# Altium schematic sheet Power.SchDoc: 电源电路
size A4
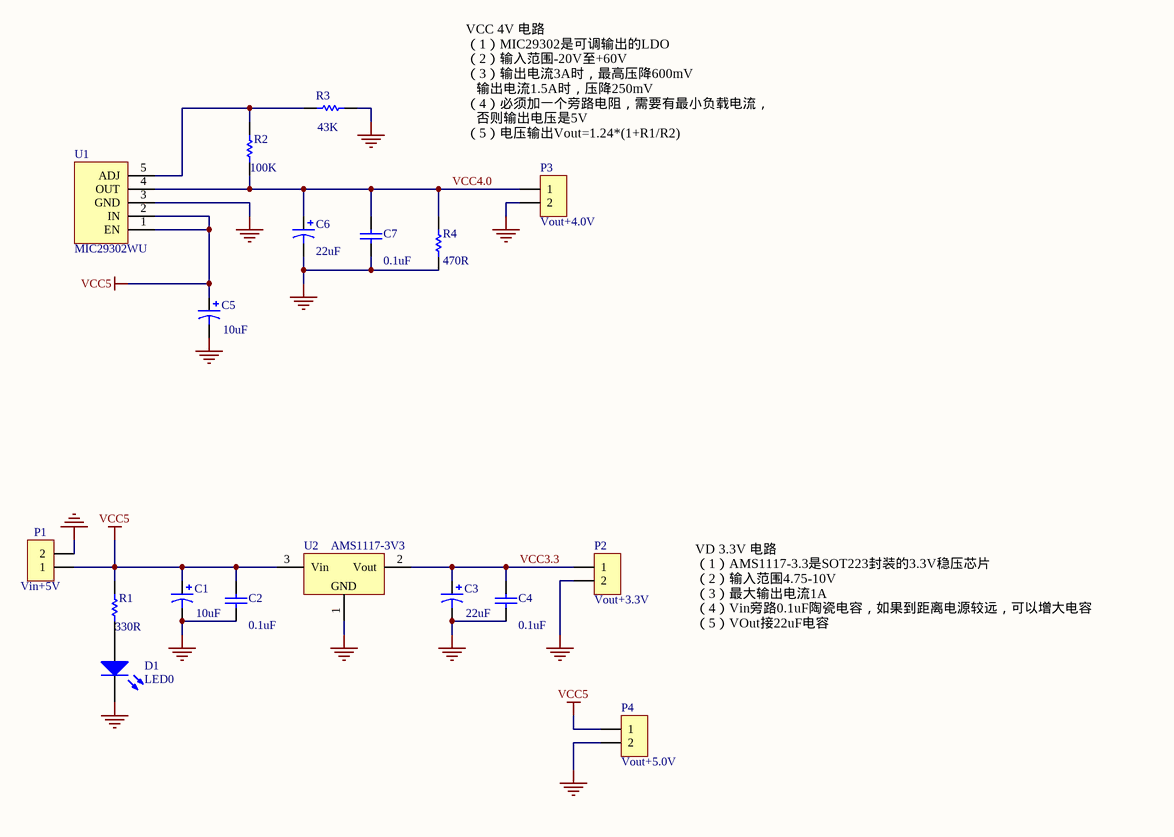
[diagram p0: Power.SchDoc]

## Parts
C1  value 10uF  [CAP 2.0*5*11 - BK]  (hidden comment: Cap Pol1)
C2  value 0.1uF  [CC 2.2*5]  (hidden comment: Cap)
C3  value 22uF  [CAP 2.0*5*11 - BK]  (hidden comment: Cap Pol1)
C4  value 0.1uF  [CC 2.2*5]  (hidden comment: Cap)
C5  value 10uF  [CAP 2.0*5*11 - BK]  (hidden comment: Cap Pol1)
C6  value 22uF  [CAP 2.0*5*11 - BK]  (hidden comment: Cap Pol1)
C7  value 0.1uF  [CC 2.2*5]  (hidden comment: Cap)
D1  LED0  [LED 3MM-R]
P1  Vin+5V  [XH2.54-2P]
P2  Vout+3.3V  [XH2.54-2P]
P3  Vout+4.0V  [XH2.54-2P]
P4  Vout+5.0V  [XH2.54-2P]
R1  value 330R  [RS 1/4W]  (hidden comment: Res1)
R2  value 100K  [RS 1/4W]  (hidden comment: Res1)
R3  value 43K  [RS 1/4W]  (hidden comment: Res1)
R4  value 470R  [RS 1/4W]  (hidden comment: Res1)
U1  MIC29302WU  [TO263-5]
U2  AMS1117-3V3  [SOT223_M]

## Nets
GND: C1.2 C2.1 C3.2 C4.1 C5.2 C6.2 C7.1 D1.2(K) P1.2 P2.2 P3.2 P4.2 R3.1 R4.1 U1.3(GND) U2.1(GND)
VCC5: C1.1 C2.2 C5.1 P1.1 P4.1 R1.2 U1.1(EN) U1.2(IN) U2.3(Vin)
VCC3.3: C3.1 C4.2 P2.1 U2.2(Vout)
VCC4.0: C6.1 C7.2 P3.1 R2.1 R4.2 U1.4(OUT)
NetD1_1: D1.1(A) R1.1
NetR2_2: R2.2 R3.2 U1.5(ADJ)

## Notes on the sheet
- (near P3) VCC 4V 电路
  （1）MIC29302是可调输出的LDO
  （2）输入范围-20V至+60V
  （3）输出电流3A时，最高压降600mV
  输出电流1.5A时，压降250mV
  （4）必须加一个旁路电阻，需要有最小负载电流，
  否则输出电压是5V
  （5）电压输出Vout=1.24*(1+R1/R2)
- VD 3.3V 电路
  （1）AMS1117-3.3是SOT223封装的3.3V稳压芯片
  （2）输入范围4.75-10V
  （3）最大输出电流1A
  （4）Vin旁路0.1uF陶瓷电容，如果到距离电源较远，可以增大电容
  （5）VOut接22uF电容

## Library data of the parts
C1 C3 C5 C6 = Cap Pol1: Polarized Capacitor (Radial); Published: 8-Jun-2000; LatestRevisionDate: 17-Jul-2002; LatestRevisionNote: Re-released for DXP Platform.; PackageReference: RB7.6-15; Publisher: Altium Limited; PackageDescription: Polarized Capacitor (Radial); 2 Leads
C2 C4 C7 = Cap: Capacitor; Published: 8-Jun-2000; LatestRevisionDate: 17-Jul-2002; LatestRevisionNote: Re-released for DXP Platform.; PackageReference: RAD-0.3; Publisher: Altium Limited; PackageDescription: Radial Cap, Thru-Hole; 2 Leads; 0.3 in Pin Spacing
D1 = LED0: Typical INFRARED GaAs LED; Published: 8-Jun-2000; LatestRevisionDate: 08-Jul-2005; LatestRevisionNote: Mech Layer 1 removed.; PackageReference: LED-0; Publisher: Altium Limited; PackageDescription: LED; 2 Leads
P1-P4 = Header 2: 2P接插件; 版权归属: 源创客; BOM名称: 2P接插件; 学习资源: www.ooocke.com
R1-R4 = Res1: Resistor; Published: 8-Jun-2000; LatestRevisionDate: 17-Jul-2002; LatestRevisionNote: Re-released for DXP Platform.; PackageReference: AXIAL-0.3; Publisher: Altium Limited; PackageDescription: Axial Device, Thru-Hole; 2 Leads; 0.3 in Pin Spacing
U1 = MIC29302WU: 2A,  adjustable LDO
U2 = AMS1117: 三端稳压芯片; BOM名称: 稳压芯片; 版权归属: 源创客; 学习资源: www.ooocke.com